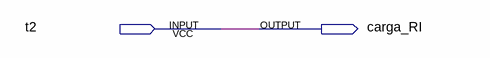
[diagram p0: schematic sheet]
// Quartus schematic carga_RI.bdf as structural Verilog: 0 symbols, 2 pins
module carga_RI (
  input  t2,
  output carga_RI
);


  assign carga_RI = t2;
endmodule
